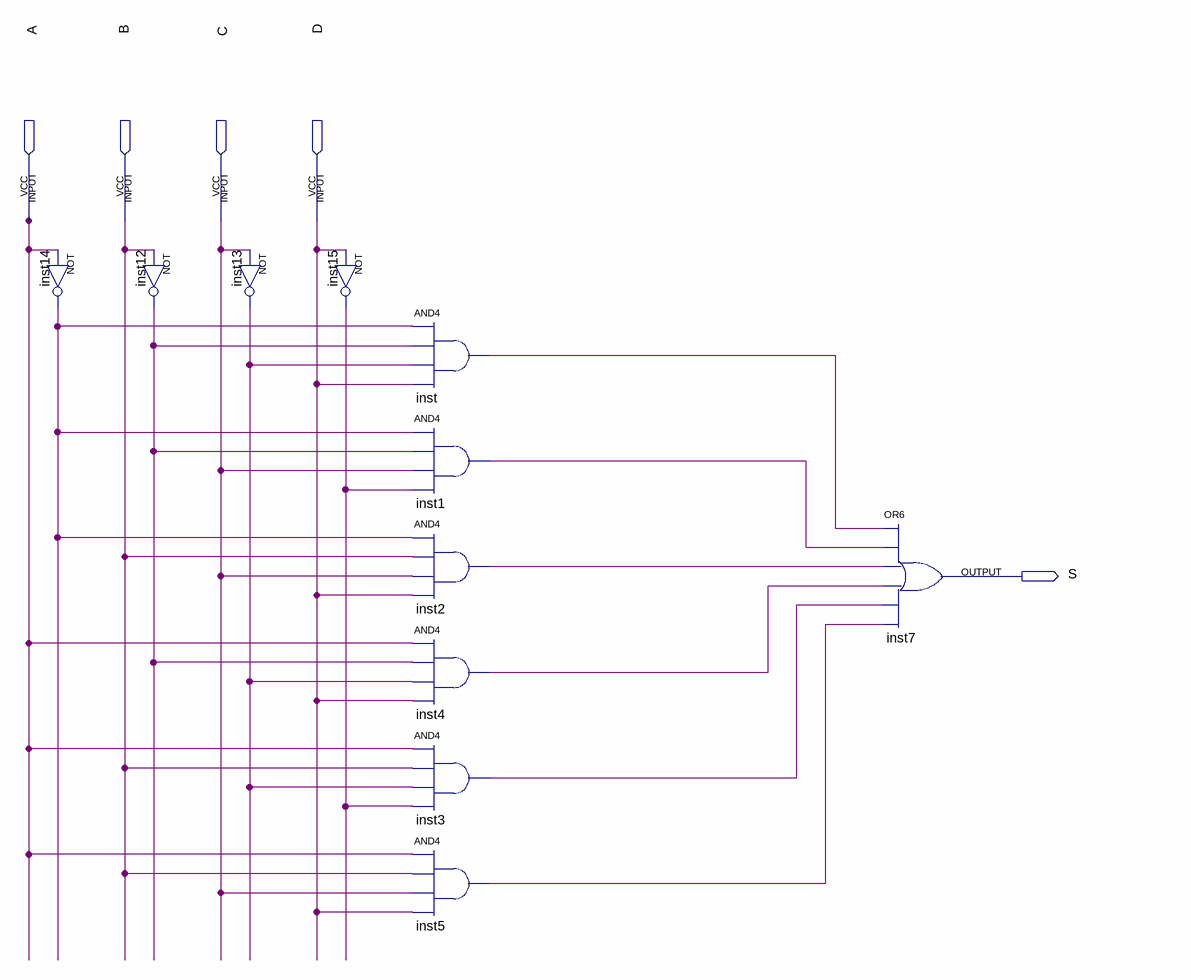
[diagram p0: schematic sheet]
// Quartus schematic Block1.bdf as structural Verilog: 11 symbols, 5 pins
module Block1 (
  input  A,
  input  B,
  input  C,
  input  D,
  output S
);

  wire inst1_out, inst2_out, inst3_out, inst4_out, inst5_out, inst12_out, inst13_out, inst14_out, inst15_out,
       inst_out;

  not inst14 (inst14_out, A);
  not inst12 (inst12_out, B);
  not inst13 (inst13_out, C);
  not inst15 (inst15_out, D);
  and inst (inst_out, inst14_out, inst12_out, inst13_out, D);
  and inst1 (inst1_out, inst14_out, inst12_out, C, inst15_out);
  and inst2 (inst2_out, inst14_out, B, C, D);
  and inst4 (inst4_out, A, inst12_out, inst13_out, D);
  and inst3 (inst3_out, A, B, inst13_out, inst15_out);
  and inst5 (inst5_out, A, B, C, D);
  or inst7 (S, inst_out, inst1_out, inst2_out, inst4_out, inst3_out, inst5_out);
endmodule
